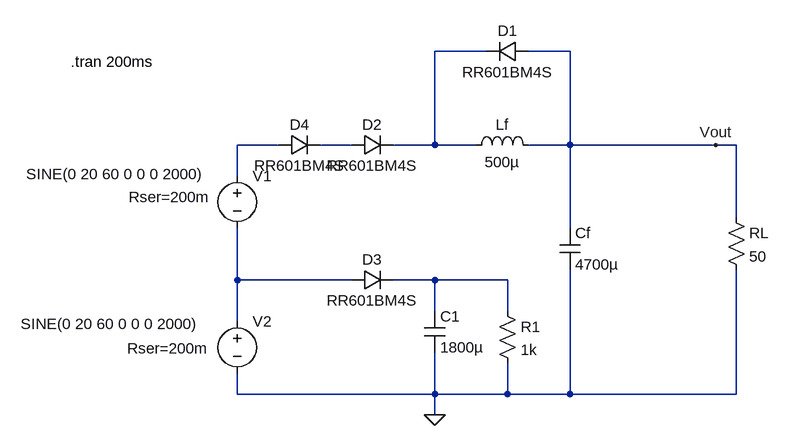
[diagram p0: schematic Solution.asc]
Solution.asc, the LTspice schematic file:
Version 4
SHEET 1 1060 680
WIRE 432 -160 352 -160
WIRE 560 -160 496 -160
WIRE 112 -16 48 -16
WIRE 224 -16 176 -16
WIRE 352 -16 352 -160
WIRE 352 -16 288 -16
WIRE 416 -16 352 -16
WIRE 560 -16 560 -160
WIRE 560 -16 496 -16
WIRE 784 -16 560 -16
WIRE 816 -16 784 -16
WIRE 48 32 48 -16
WIRE 816 96 816 -16
WIRE 560 112 560 -16
WIRE 48 192 48 112
WIRE 224 192 48 192
WIRE 352 192 288 192
WIRE 464 192 352 192
WIRE 352 240 352 192
WIRE 464 240 464 192
WIRE 48 256 48 192
WIRE 48 368 48 336
WIRE 352 368 352 304
WIRE 352 368 48 368
WIRE 464 368 464 320
WIRE 464 368 352 368
WIRE 560 368 560 176
WIRE 560 368 464 368
WIRE 816 368 816 176
WIRE 816 368 560 368
WIRE 352 400 352 368
FLAG 352 400 0
FLAG 784 -16 Vout
SYMBOL voltage 48 16 R0
WINDOW 3 -325 13 Left 2
WINDOW 123 0 0 Left 0
WINDOW 39 -167 48 Left 2
SYMATTR InstName V1
SYMATTR Value SINE(0 20 60 0 0 0 2000)
SYMATTR SpiceLine Rser=200m
SYMBOL voltage 48 240 R0
WINDOW 3 -333 20 Left 2
WINDOW 123 0 0 Left 0
WINDOW 39 -169 57 Left 2
SYMATTR InstName V2
SYMATTR Value SINE(0 20 60 0 0 0 2000)
SYMATTR SpiceLine Rser=200m
SYMBOL diode 224 0 R270
WINDOW 0 32 32 VTop 2
WINDOW 3 0 32 VBottom 2
SYMATTR InstName D2
SYMATTR Value RR601BM4S
SYMBOL cap 336 240 R0
SYMATTR InstName C1
SYMATTR Value 1800µ
SYMATTR SpiceLine V=35 Rser=2m Rpar=10Meg
SYMBOL res 448 224 R0
SYMATTR InstName R1
SYMATTR Value 1k
SYMBOL res 800 80 R0
SYMATTR InstName RL
SYMATTR Value 50
SYMBOL diode 224 208 R270
WINDOW 0 32 32 VTop 2
WINDOW 3 0 32 VBottom 2
SYMATTR InstName D3
SYMATTR Value RR601BM4S
SYMBOL cap 544 112 R0
SYMATTR InstName Cf
SYMATTR Value 4700µ
SYMATTR SpiceLine V=50 Rser=2m Rpar=10Meg
SYMBOL ind 400 0 R270
WINDOW 0 32 56 VTop 2
WINDOW 3 5 56 VBottom 2
SYMATTR InstName Lf
SYMATTR Value 500µ
SYMATTR SpiceLine Rser=2m Rpar=1Meg
SYMBOL diode 496 -176 R90
WINDOW 0 0 32 VBottom 2
WINDOW 3 32 32 VTop 2
SYMATTR InstName D1
SYMATTR Value RR601BM4S
SYMBOL diode 112 0 R270
WINDOW 0 32 32 VTop 2
WINDOW 3 0 32 VBottom 2
SYMATTR InstName D4
SYMATTR Value RR601BM4S
TEXT -208 -144 Left 2 !.tran 200ms

The netlist it stands for:
* Solution.asc
V1 N002 N004 SINE(0 20 60 0 0 0 2000) Rser=200m
V2 N004 0 SINE(0 20 60 0 0 0 2000) Rser=200m
D2 N003 N001 RR601BM4S
C1 N005 0 1800µ V=35 Rser=2m Rpar=10Meg
R1 N005 0 1k
RL Vout 0 50
D3 N004 N005 RR601BM4S
Cf Vout 0 4700µ V=50 Rser=2m Rpar=10Meg
Lf N001 Vout 500µ Rser=2m Rpar=1Meg
D1 Vout N001 RR601BM4S
D4 N002 N003 RR601BM4S
.model D D
.lib standard.dio
.tran 200ms
.backanno
.end